# EAGLE schematic controller (EAGLE 7.2.0)
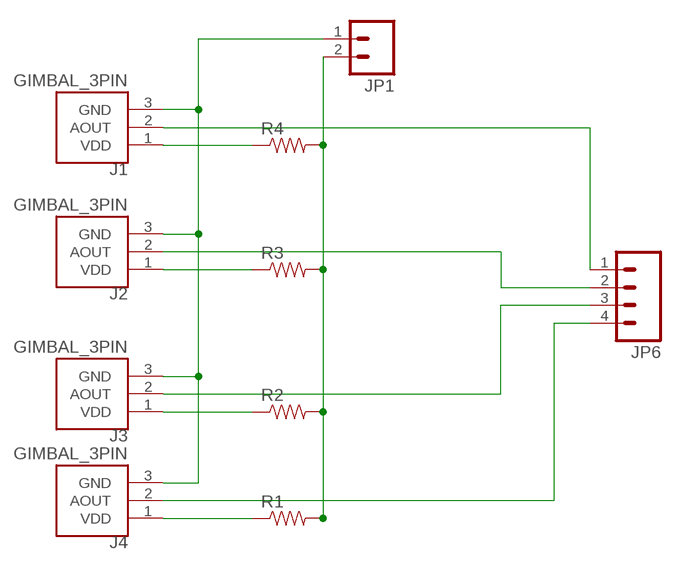
[diagram p0: schematic, sheet 1]

## Parts
J1  GIMBAL_3PIN  [JST-3-PTH]
J2  GIMBAL_3PIN  [JST-3-PTH]
J3  GIMBAL_3PIN  [JST-3-PTH]
J4  GIMBAL_3PIN  [JST-3-PTH]
JP1  M02LOCK  [1X02_LOCK]
JP6  M04PTH  [1X04]
R1  RESISTORPTH-1/6W  [1/6W-RES]
R2  RESISTORPTH-1/6W  [1/6W-RES]
R3  RESISTORPTH-1/6W  [1/6W-RES]
R4  RESISTORPTH-1/6W  [1/6W-RES]

## Nets
3.3V: JP1.2 R1.2 R2.2 R3.2 R4.2
GND: J1.3(GND) J2.3(GND) J3.3(GND) J4.3(GND) JP1.1
N$1: J4.1(VDD) R1.1
N$2: J3.1(VDD) R2.1
N$3: J2.1(VDD) R3.1
N$4: J1.1(VDD) R4.1
N$5: J1.2(AOUT) JP6.1
N$6: J2.2(AOUT) JP6.2
N$7: J3.2(AOUT) JP6.3
N$8: J4.2(AOUT) JP6.4

## Library data of the parts
J1-J4 = Controller:GIMBAL_3PIN: This is the surface mount connector for the 9XR Replacement Gimbal. It uses a 3 Pin, 2 mm Pitch, JST connector (https://www.sparkfun.com/products/9750) You can see the analog transmitter here: http://www.hobbyking.com/hobbyking/store/__39505__Transmitter_Gimbal_Set_Left_Turnigy_9XR_Transmitter_Mode_1.html The black wire is VDD, the White wire is Ground, the Red wire is Analog Out Author: Dustin Richmond Created: 10/25/2014
JP1 = SparkFun-Connectors:M02: Standard 2-pin 0.1" header. Use with - straight break away headers ( PRT-00116) - right angle break away headers (PRT-00553) - swiss pins (PRT-00743) - machine pins (PRT-00117) - female headers (PRT-00115) Molex polarized connector foot print use with: PRT-08233 with associated crimp pins and housings. 2.54_SCREWTERM for use with PRT-10571. 3.5mm Screw Terminal footprints for PRT-08084 5mm Screw Terminal footprints for use with PRT-08432
JP6 = SparkFun-Connectors:M04: Header 4 Standard 4-pin 0.1" header. Use with straight break away headers (SKU : PRT-00116), right angle break away headers (PRT-00553), swiss pins (PRT-00743), machine pins (PRT-00117), and female headers (PRT-00115). Molex polarized connector foot print use with SKU : PRT-08231 with associated crimp pins and housings. 1MM SMD Version SKU: PRT-10208
R1-R4 = SparkFun-Resistors:RESISTOR: Resistor Basic schematic elements and footprints for 0603, 1206, and PTH resistors.